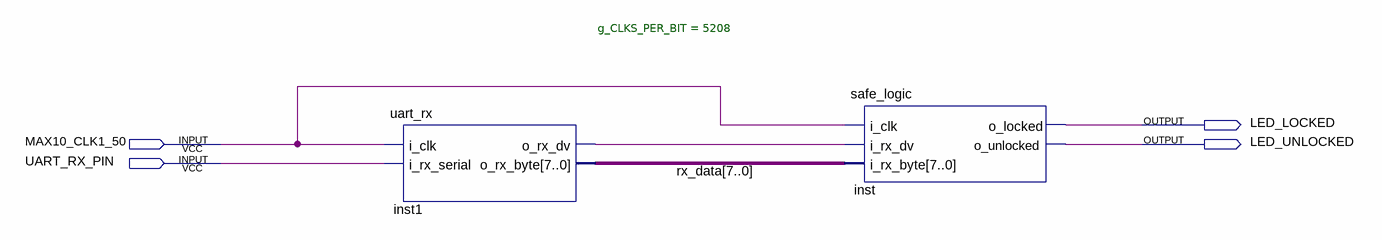
[diagram p0: schematic sheet]
// Quartus schematic SmartSafe.bdf as structural Verilog: 2 symbols, 4 pins
module SmartSafe (
  input  MAX10_CLK1_50,
  input  UART_RX_PIN,
  output LED_LOCKED,
  output LED_UNLOCKED
);

  wire inst1_o_rx_dv;
  wire [7:0] rx_data;

  uart_rx #(.g_CLKS_PER_BIT(5208)) inst1 (
    .i_clk(MAX10_CLK1_50), .i_rx_serial(UART_RX_PIN), .o_rx_dv(inst1_o_rx_dv), .o_rx_byte(rx_data));
  safe_logic inst (
    .i_clk(MAX10_CLK1_50), .i_rx_dv(inst1_o_rx_dv), .i_rx_byte(rx_data), .o_locked(LED_LOCKED),
    .o_unlocked(LED_UNLOCKED));
endmodule
